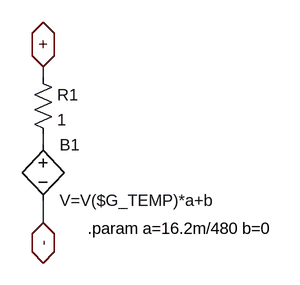
[diagram p0: schematic Thermocouple.asc]
Thermocouple.asc, the LTspice schematic file:
Version 4
SHEET 1 880 680
WIRE 112 16 112 0
WIRE 112 112 112 96
WIRE 112 224 112 192
FLAG 112 0 +
IOPIN 112 0 BiDir
FLAG 112 224 -
IOPIN 112 224 BiDir
SYMBOL bv 112 96 R0
SYMATTR InstName B1
SYMATTR Value V=V($G_TEMP)*a+b
SYMBOL res 96 0 R0
SYMATTR InstName R1
SYMATTR Value 1
TEXT 176 232 Left 2 !.param a=16.2m/480 b=0

The netlist it stands for:
* Thermocouple.asc
B1 N001 - V=V($G_TEMP)*a+b
R1 + N001 1
.param a=16.2m/480 b=0
.backanno
.end